# EAGLE design Main_Board (EAGLE 9.7.0)
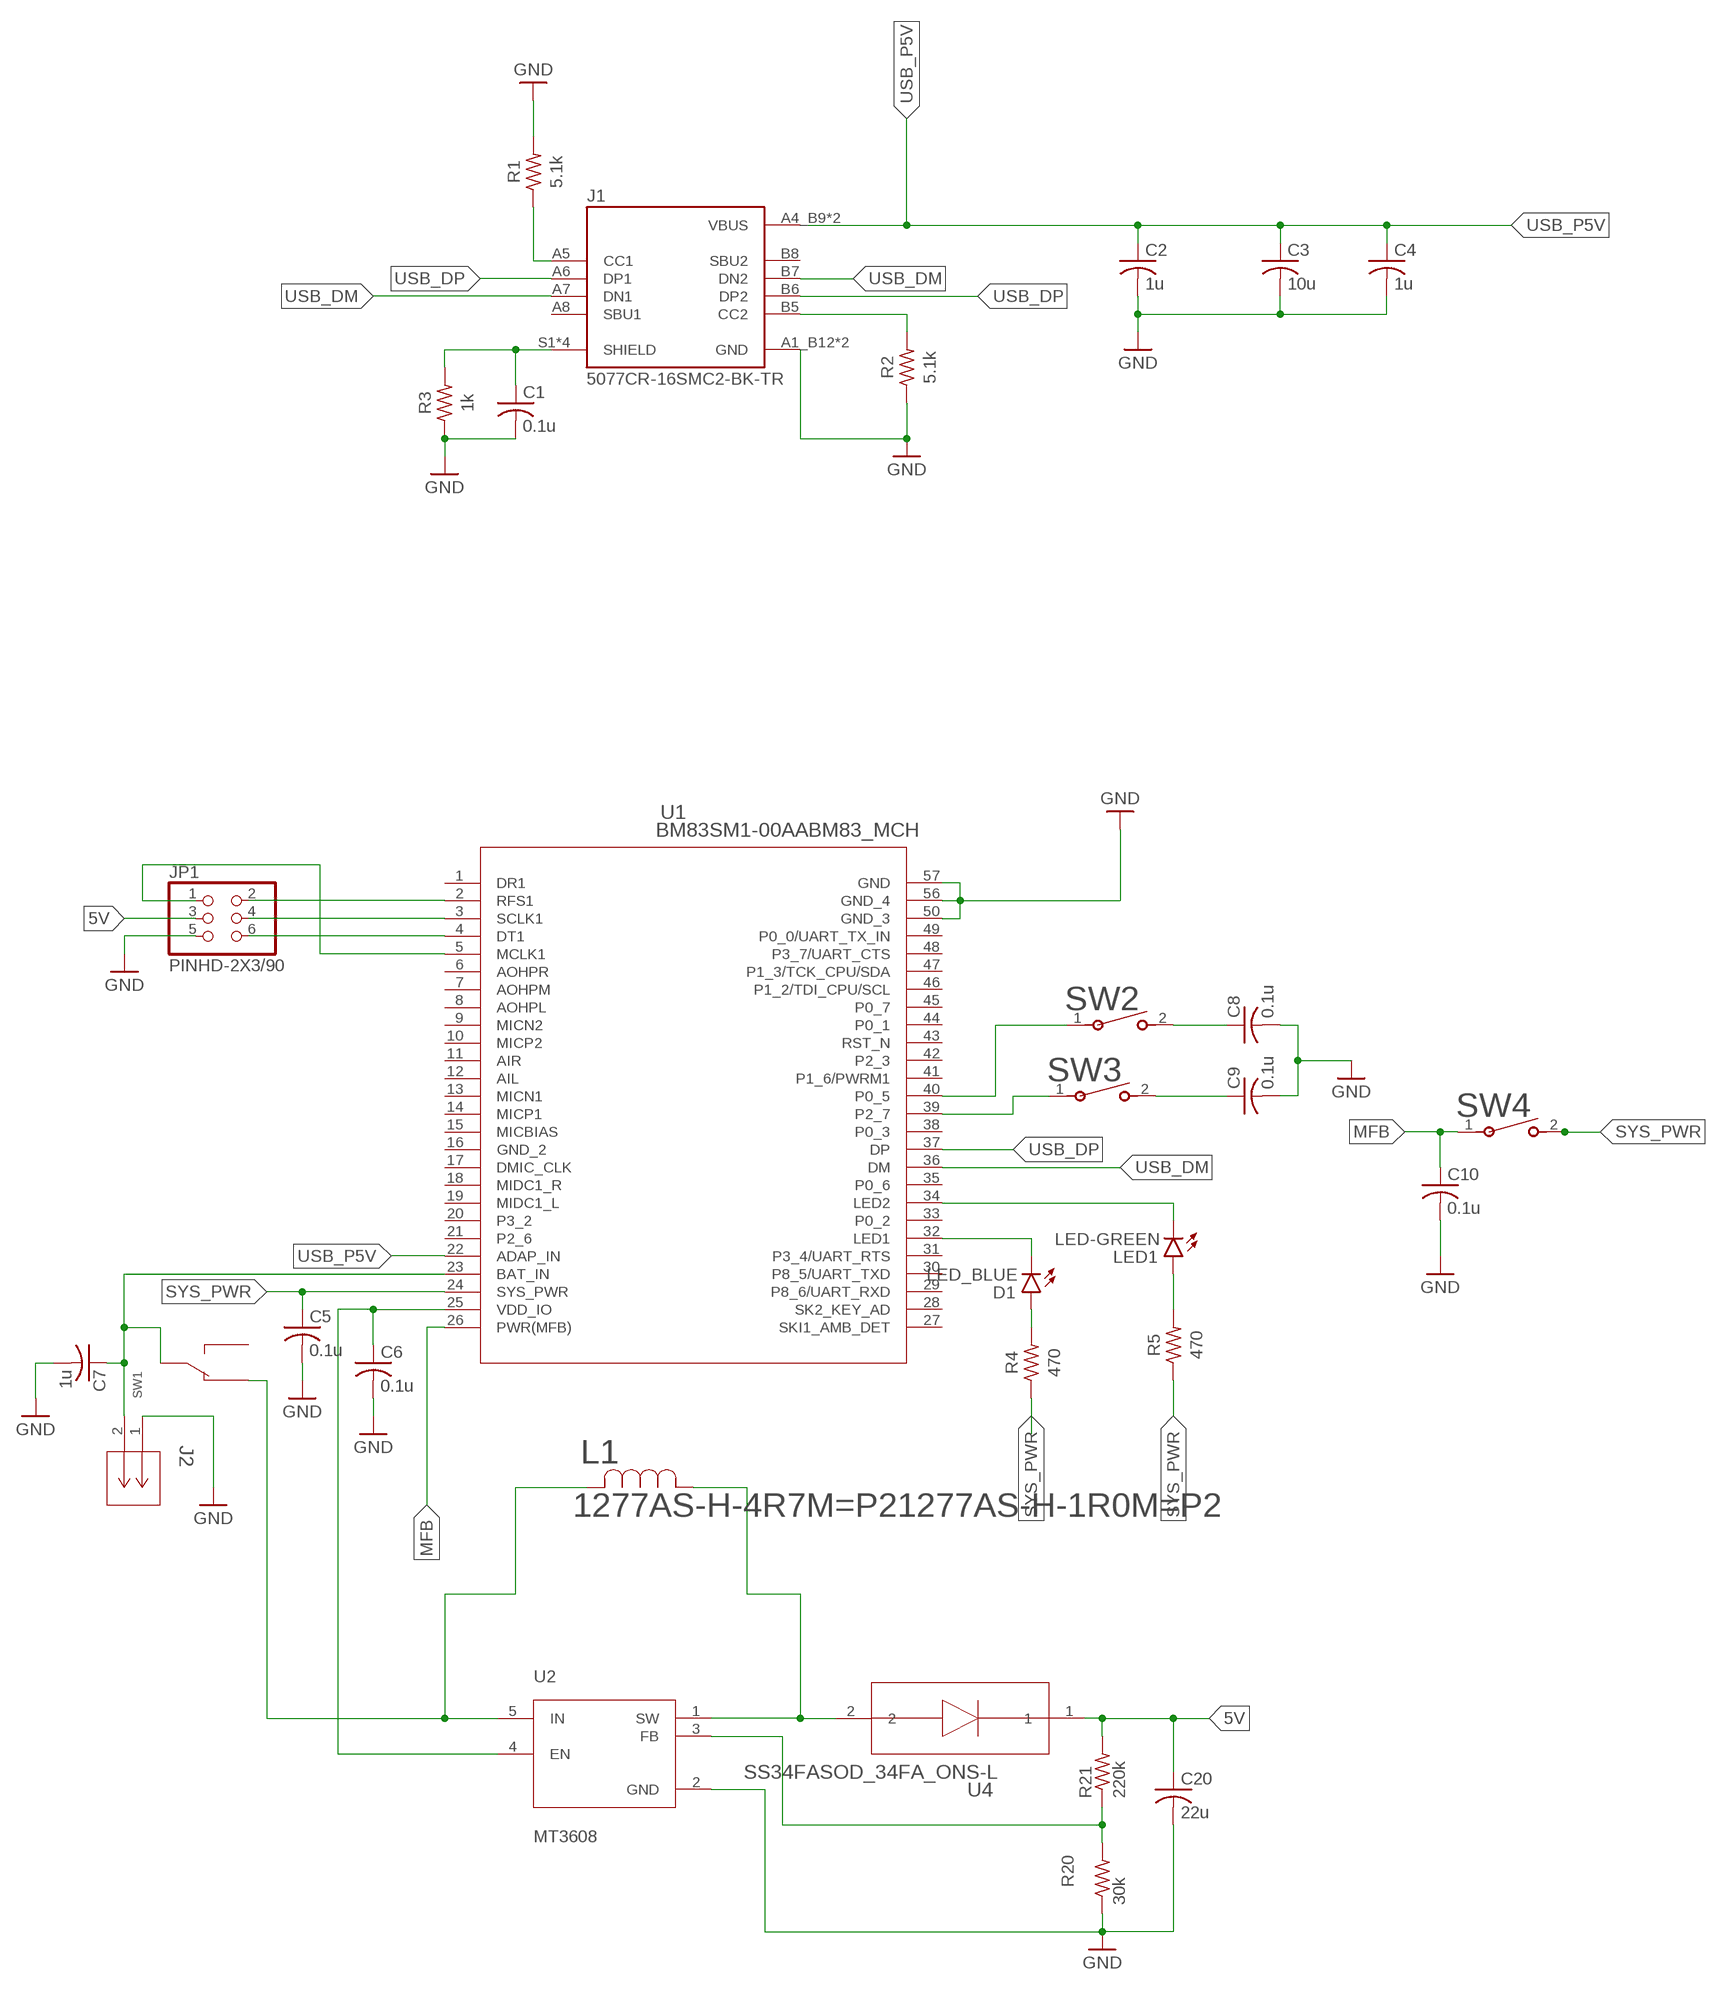
[diagram p0: schematic, sheet 1]

## Parts
C1  0.1u  C-US_CHIP-0603(1608-METRIC)  [CAPC1608X85]
C2  1u  C-US_CHIP-0603(1608-METRIC)  [CAPC1608X85]
C3  10u  C-US_CHIP-0603(1608-METRIC)  [CAPC1608X85]
C4  1u  C-US_CHIP-0603(1608-METRIC)  [CAPC1608X85]
C5  0.1u  C-US_CHIP-0603(1608-METRIC)  [CAPC1608X85]
C6  0.1u  C-US_CHIP-0603(1608-METRIC)  [CAPC1608X85]
C7  1u  C-US_CHIP-0603(1608-METRIC)  [CAPC1608X85]
C8  0.1u  C-US_CHIP-0603(1608-METRIC)  [CAPC1608X85]
C9  0.1u  C-US_CHIP-0603(1608-METRIC)  [CAPC1608X85]
C10  0.1u  C-US_CHIP-0603(1608-METRIC)  [CAPC1608X85]
C20  22u  C-US_CHIP-1206(3216-METRIC)  [CAPC3216X135]
D1  LED_BLUE  LED_CHIP_BLUE-1608  [LEDC1608X39N_B]
J1  5077CR-16SMC2-BK-TR  [NELTRON_5077CR-16SMC2-BK-TR]
J2  S2B-PH-K-S(LF)(SN)  [CONN_S2B-PH-K-S_JST]
JP1  PINHD-2X3/90  [2X03/90]
L1  1277AS-H-4R7M=P21277AS-H-1R0M=P2  [1277AS-H-1R0M=P2]
LED1  LED-GREEN  LED_CHIP_GREEN-1608  [LEDC1608X39N_G]
R1  5.1k  R-US_CHIP-0603(1608-METRIC)  [RESC1608X60]
R2  5.1k  R-US_CHIP-0603(1608-METRIC)  [RESC1608X60]
R3  1k  R-US_CHIP-0603(1608-METRIC)  [RESC1608X60]
R4  470  R-US_CHIP-0603(1608-METRIC)  [RESC1608X60]
R5  470  R-US_CHIP-0603(1608-METRIC)  [RESC1608X60]
R20  30k  R-US_CHIP-0603(1608-METRIC)  [RESC1608X60]
R21  220k  R-US_CHIP-0603(1608-METRIC)  [RESC1608X60]
SW1  MMS124  [MMS124]
SW2  EVP-AKE31ASW_EVP-AKE31A_PAN  [SW_EVP-AKE31A_PAN]
SW3  EVP-AKE31ASW_EVP-AKE31A_PAN  [SW_EVP-AKE31A_PAN]
SW4  EVP-AKE31ASW_EVP-AKE31A_PAN  [SW_EVP-AKE31A_PAN]
U1  BM83SM1-00AABM83_MCH  [BM83_MCH]
U2  MT3608  [SOT95P280X145-6N]
U4  SS34FASOD_34FA_ONS-L  [SOD_34FA_ONS-L]

## Nets
5V: C20.1 JP1.3 R21.2 U4.1
GND: C1.2 C2.2 C3.2 C4.2 C5.2 C6.2 C7.2 C8.2 C9.2 C10.2 C20.2 J1.A1_B12(GND) J1.B1_A12(GND) J2.1 JP1.5 R1.2 R2.1 R3.1 R20.1 U1.50(GND_3) U1.56(GND_4) U1.57(GND) U2.2(GND)
MFB: C10.1 SW4.1 U1.26(PWR(MFB))
N$1: J1.A5(CC1) R1.1
N$2: J1.B5(CC2) R2.2
N$3: C1.1 J1.S1(SHIELD) J1.S2(SHIELD) J1.S3(SHIELD) J1.S4(SHIELD) R3.2
N$4: L1.1 U2.1(SW) U4.2
N$5: JP1.2 U1.2(RFS1)
N$6: JP1.4 U1.3(SCLK1)
N$7: JP1.6 U1.4(DT1)
N$8: JP1.1 U1.5(MCLK1)
N$9: C7.1 J2.2 SW1.3 U1.23(BAT_IN)
N$10: SW2.1 U1.40(P0_5)
N$11: SW3.1 U1.39(P2_7)
N$12: C8.1 SW2.2
N$13: C9.1 SW3.2
N$20: R20.2 R21.1 U2.3(FB)
N$22: L1.2 SW1.1 U2.5(IN)
N$23: C6.1 U1.25(VDD_IO) U2.4(EN)
N$27: D1.1(C) U1.32(LED1)
N$28: D1.2(A) R4.2
N$29: LED1.1(C) U1.34(LED2)
N$30: LED1.2(A) R5.2
SYS_PWR: C5.1 R4.1 R5.1 SW4.2 U1.24(SYS_PWR)
USB_DM: J1.A7(DN1) J1.B7(DN2) U1.36(DM)
USB_DP: J1.A6(DP1) J1.B6(DP2) U1.37(DP)
USB_P5V: C2.1 C3.1 C4.1 J1.A4_B9(VBUS) J1.B4_A9(VBUS) U1.22(ADAP_IN)
Unconnected: J1.A8(SBU1) J1.B8(SBU2) SW1.2 U1.1(DR1) U1.6(AOHPR) U1.7(AOHPM) U1.8(AOHPL) U1.9(MICN2) U1.10(MICP2) U1.11(AIR) U1.12(AIL) U1.13(MICN1) U1.14(MICP1) U1.16(GND_2) U1.17(DMIC_CLK) U1.18(MIDC1_R) U1.19(MIDC1_L) U1.20(P3_2) U1.21(P2_6) U1.27(SKI1_AMB_DET) U1.28(SK2_KEY_AD) U1.29(P8_6/UART_RXD) U1.30(P8_5/UART_TXD) U1.31(P3_4/UART_RTS) U1.33(P0_2) U1.35(P0_6) U1.38(P0_3) U1.41(P1_6/PWRM1) U1.42(P2_3) U1.43(RST_N) U1.44(P0_1) U1.45(P0_7) U1.46(P1_2/TDI_CPU/SCL) U1.47(P1_3/TCK_CPU/SDA) U1.48(P3_7/UART_CTS) U1.49(P0_0/UART_TX_IN)

## Power pins joined to a net without a drawn wire
MICBIAS: U1.15(MICBIAS)

## Library data of the parts
C1-C10 C20 = Capacitor:C-US: Capacitor - ANSI; CATEGORY: Capacitor
D1 = Opto-Electronic:LED_CHIP: LED - Generic; CATEGORY: Opto-Electronic; COLOR: Blue; SUB-CATEGORY: LED
J1 = 5077CR-16SMC2-BK-TR:5077CR-16SMC2-BK-TR: Check availability <https://pricing.snapeda.com/parts/5077CR-16SMC2-BK-TR/Neltron/view-part?ref=eda>; AVAILABILITY: Not in stock; CHECK_PRICES: https://www.snapeda.com/parts/5077CR-16SMC2-BK-TR/Neltron/view-part/?ref=eda; DESCRIPTION: USB 3.1 C Type Female with Peg; MF: Neltron; MP: 5077CR-16SMC2-BK-TR; PACKAGE: Package; PRICE: None; SNAPEDA_LINK: https://www.snapeda.com/parts/5077CR-16SMC2-BK-TR/Neltron/view-part/?ref=snap
J2 = LipoConnector:S2B-PH-K-S(LF)(SN); COPYRIGHT: Copyright (C) 2024 Ultra Librarian. All rights reserved.; MANUFACTURER_PART_NUMBER: S2B-PH-K-S(LF)(SN); MFR_NAME: JST
JP1 = Connector:PINHD-2X3: PIN HEADER; CATEGORY: Headers; DESCRIPTION: Header, Right Angle, 2x3 Position; MANUFACTURER: Generic; MPN: Generic; OPERATING_TEMPERATURE: Generic; PART_STATUS: Active; PITCH: 0.100" (2.54mm); ROHS_COMPLIANCE: Generic; SERIES: Generic; SUB-CATEGORY: Headers, Male Pins; TYPE: Board to Board or Cable, Unshrouded, Through Hole, Right Angle
L1 = 2024-11-07_09-45-20_Library:1277AS-H-4R7M=P2; COPYRIGHT: Copyright (C) 2024 Ultra Librarian. All rights reserved.; MANUFACTURER_PART_NUMBER: 1277AS-H-4R7M=P2; MFR_NAME: Murata
LED1 = Tutorial - Fusion 360:LED_CHIP: LED - Generic; CATEGORY: Opto-Electronic; COLOR: Green; SUB-CATEGORY: LED
R1-R5 = Resistor:R-US: Resistor Fixed - ANSI; CATEGORY: Resistor; SUB-CATEGORY: Fixed
R20 R21 = Tutorial - Fusion 360:R-US: Resistor Fixed - ANSI; CATEGORY: Resistor; SUB-CATEGORY: Fixed
SW1 = KnitterSwitch:MMS124
SW2-SW4 = EVPAKE31A:EVP-AKE31A; COPYRIGHT: Copyright (C) 2024 Ultra Librarian. All rights reserved.; MANUFACTURER_PART_NUMBER: EVP-AKE31A; MFR_NAME: Panasonic
U1 = 2024-10-16_09-55-49_Library:BM83SM1-00AA; COPYRIGHT: Copyright (C) 2024 Ultra Librarian. All rights reserved.; MANUFACTURER_PART_NUMBER: BM83SM1-00AA; MFR_NAME: Microchip
U2 = MT3608:MT3608: High Efficiency 1.2MHz 2A Step Up Converter Check availability <https://pricing.snapeda.com/parts/MT3608/Aerosemi%20Technology%20Co.%2C%20Ltd/view-part?ref=eda>; AVAILABILITY: Not in stock; CHECK_PRICES: https://www.snapeda.com/parts/MT3608/Aerosemi+Technology+Co.%252C+Ltd/view-part/?ref=eda; DESCRIPTION: High Efficiency 1.2MHz 2A Step Up Converter; MF: Aerosemi Technology Co., Ltd; MP: MT3608; PACKAGE: Package; PRICE: None; SNAPEDA_LINK: https://www.snapeda.com/parts/MT3608/Aerosemi+Technology+Co.%252C+Ltd/view-part/?ref=snap
U4 = 2024-10-24_17-08-58_Library:SS34FA; COPYRIGHT: Copyright (C) 2024 Ultra Librarian. All rights reserved.; MANUFACTURER_PART_NUMBER: SS34FA; MFR_NAME: onsemi

## Board
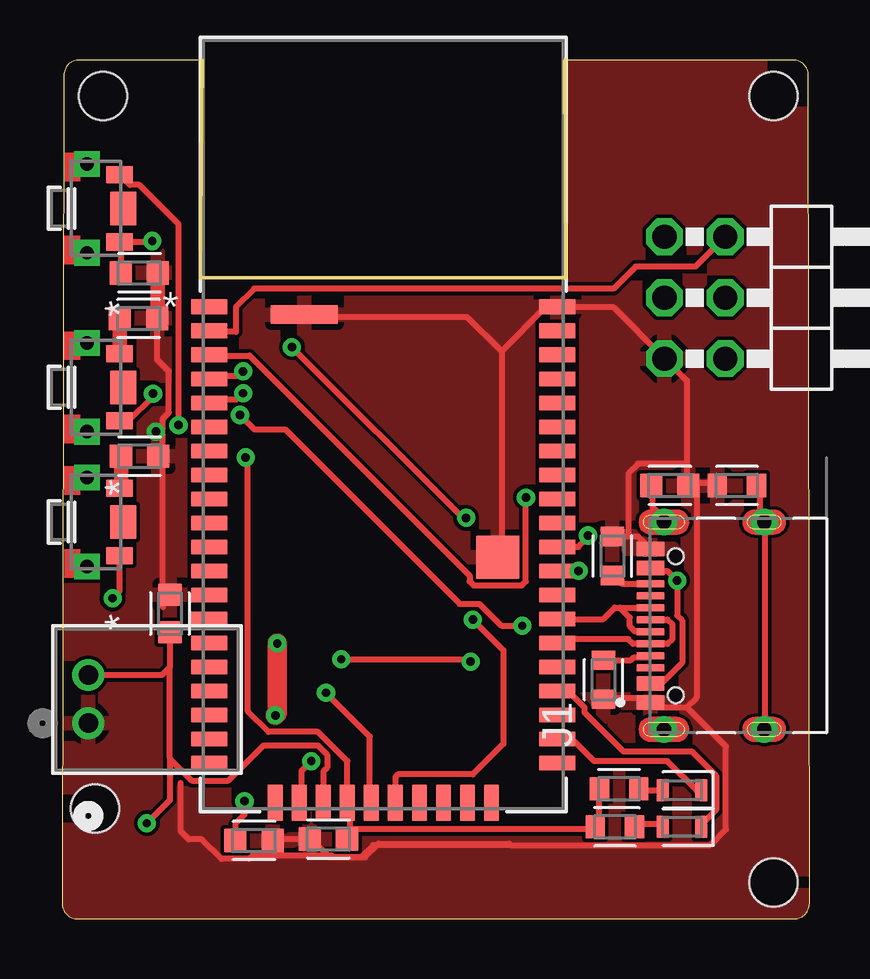
[diagram p1: board, top side]
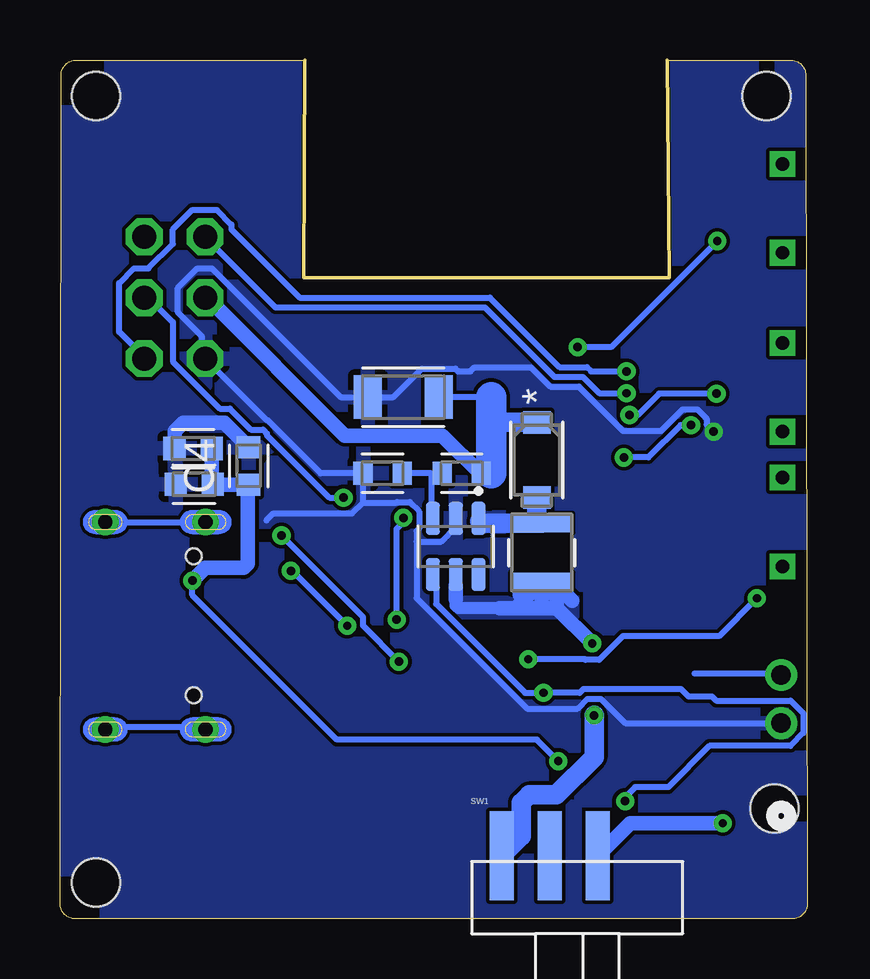
[diagram p2: board, bottom side, seen from below]

Size 31.14 x 35.79 mm. Coordinates in mm from the lower left corner, seen from the top.
Outline: 0.07,35.15 0,0.64 arc90 0.64,0 30.51,0 arc90 31.14,0.64 31.1,35.15 arc90 30.46,35.79 20.95,35.79 20.98,26.72 5.75,26.72 5.85,35.79 0.71,35.79 arc90 0.07,35.15
Copper layers (1*16): Top 0.035mm / dielectric 1.5mm / Bottom 0.035mm
Design rules "Fusion Electronics Design Rules *": minimum track width 10mil, minimum drill 0.35mm, track to track 6mil, track to pad 6mil, pad to pad 6mil, via to via 6mil, smd to smd 6mil, copper to edge 1mil, drill to drill 6mil, minimum pad ring 10mil, minimum via ring 8mil, stop-mask expansion 4mil, vias tented up to drill 0mil, thermal gap 10mil
Holes 2 mm at 1.7,34.29 1.37,4.6 29.64,34.29 29.64,1.52

### Footprints (pad centres in the part's own frame; a part is rotated, then mirrored left to right if it is on the bottom)
CAPC1608X85 = smd 0.921 x 0.97: 1 -0.775,0; 2 0.775,0
CAPC3216X135 = smd 1.165 x 1.815: 1 -1.475,0; 2 1.475,0
LEDC1608X39N_B = smd 0.512 x 0.912: 1 -0.8,0; 2 0.8,0
NELTRON_5077CR-16SMC2-BK-TR = smd 0.6 x 1.15: A1_B12 -3.2,1.065; A4_B9 -2.4,1.065; B1_A12 3.2,1.065; B4_A9 2.4,1.065 | smd 0.3 x 1.15: A5 -1.25,1.065; A6 -0.25,1.065; A7 0.25,1.065; A8 1.25,1.065; B5 1.75,1.065; B6 0.75,1.065; B7 -0.75,1.065; B8 -1.75,1.065 | drill 0.6 pad 1: S1 -4.32,-3.68; S2 4.32,-3.68; S3 -4.32,0.5; S4 4.32,0.5 | hole 0.65: -2.89,0; 2.89,0
CONN_S2B-PH-K-S_JST = drill 0.813 pad 1.321: 1 0,0; 2 2.007,0
2X03/90 = drill 1.016 octagon: 1 -2.54,-6.35; 2 -2.54,-3.81; 3 0,-6.35; 4 0,-3.81; 5 2.54,-6.35; 6 2.54,-3.81
1277AS-H-1R0M=P2 = smd 0.75 x 2.489: 1 -1.225,0; 2 1.225,0
LEDC1608X39N_G = smd 0.512 x 0.912: 1 -0.8,0; 2 0.8,0
RESC1608X60 = smd 0.799 x 0.974: 1 -0.815,0; 2 0.815,0
MMS124 = smd 1 x 3.7: 1 -3.15,3.25; 2 -1.15,3.25; 3 0.85,3.25
SW_EVP-AKE31A_PAN = smd 0.711 x 1.092: 1 -1.4,-0.972; 2 1.4,-0.972 | drill 0.559 pad 0.914 square: 3 -1.848,0.381; 4 1.848,0.381 | smd 1.397 x 1.092: 5 0,-1.124
BM83_MCH = smd 1.499 x 0.61: 1 -7.25,4.907; 2 -7.25,3.906; 3 -7.25,2.906; 4 -7.25,1.905; 5 -7.25,0.904; 6 -7.25,-0.097; 7 -7.25,-1.097; 8 -7.25,-2.098; 9 -7.25,-3.099; 10 -7.25,-4.1; 11 -7.25,-5.1; 12 -7.25,-6.101; 13 -7.25,-7.102; 14 -7.25,-8.103; 15 -7.25,-9.103; 16 -7.25,-10.104; 17 -7.25,-11.105; 18 -7.25,-12.106; 19 -7.25,-13.106; 20 -7.25,-14.107; 31 7.25,-14.107; 32 7.25,-13.106; 33 7.25,-12.106; 34 7.25,-11.105; 35 7.25,-10.104; 36 7.25,-9.103; 37 7.25,-8.103; 38 7.25,-7.102; 39 7.25,-6.101; 40 7.25,-5.1; 41 7.25,-4.1; 42 7.25,-3.099; 43 7.25,-2.098; 44 7.25,-1.097; 45 7.25,-0.097; 46 7.25,0.904; 47 7.25,1.905; 48 7.25,2.906; 49 7.25,3.906; 50 7.25,4.907 | smd 0.61 x 1.499: 21 -4.503,-15.751; 22 -3.503,-15.751; 23 -2.502,-15.751; 24 -1.501,-15.751; 25 -0.5,-15.751; 26 0.5,-15.751; 27 1.501,-15.751; 28 2.502,-15.751; 29 3.503,-15.751; 30 4.503,-15.751 | smd 1.778 x 1.778: 56 4.77,-5.53 | smd 2.794 x 0.762: 57 -3.289,4.58
SOT95P280X145-6N = smd 1.37 x 0.59: 1 -1.17,0.95; 2 -1.17,0; 3 -1.17,-0.95; 4 1.17,-0.95; 5 1.17,0; 6 1.17,0.95
SOD_34FA_ONS-L = smd 0.94 x 1.143: 1 -1.562,0; 2 1.562,0

### Placement (x,y rotation side)
C1  25.32,18.06 0 top
C2  25.55,18.11 180 bottom
C3  25.6,19.6 180 bottom
C4  23.28,18.87 90 bottom
C5  11.1,3.33 180 top
C6  8,3.27 0 top
C7  4.49,12.73 90 top
C8  3.23,19.27 0 top
C9  3.18,25.02 0 top
C10  3.22,26.92 0 top
C20  16.84,21.74 180 bottom
D1  25.83,5.36 180 top
J1  25.58,12.22 90 top
J2  1.09,8.15 90 top
JP1  31.44,25.88 270 top
L1  11.07,15.27 270 bottom
LED1  25.83,3.84 180 top
R1  22.56,9.97 270 top
R2  22.93,15.12 270 top
R3  28.12,18.06 0 top
R4  23.21,5.42 0 top
R5  23.04,3.84 0 top
R20  17.7,18.57 0 bottom
R21  14.4,18.57 0 bottom
SW1  9.59,-0.61 0 bottom
SW2  1.42,16.54 90 top
SW3  1.42,22.15 90 top
SW4  1.42,29.6 90 top
U1  13.38,20.6 0 top
U2  14.65,15.52 270 bottom
U4  11.28,19.13 270 bottom

### Tracks (layer width: path | path; a pad name or v marks a point on that pad's centre or on a via)
5V
  Bottom 0.254: 13.23,18.57 R21.2 | 13.44,18.57 R21.2 | 13.18,21.74 C20.1 | R21.2 13.64,18.57 | JP1.3 25.02,25.88
  Bottom 0.61: 13.64,18.57 15.21,20.14 19.28,20.14 25.02,25.88
  Bottom 0.813: 13.18,18.57 13.23,18.57 | U4.1 11.29,20.7 13.18,20.7
  Bottom 1.27: 13.18,18.57 13.18,20.7 13.18,21.74
GND  (via drill 0.35)
  Top 0.254: C6.2 8.87,3.33 10.18,3.33 C5.2 10.39,3.33 11.15,2.57 12.62,2.57 13.19,3.14 18.62,3.14 18.69,3.07 | R1.2 22.58,9.22 24.41,9.22 J1.A1_B12 24.61,9.02 24.81,8.81 26.03,8.81 | 26.03,8.81 27.66,7.19 27.66,3.73 27,3.07 18.69,3.07 | 4.49,13.69 C7.2 | 23.6,15.93 24,15.93 24.41,15.52 J1.B1_A12 | 23.6,15.93 23.06,15.93 R2.1 | 26.44,18.16 27.25,18.16 R3.1 | 26.44,18.16 26.24,18.16 C1.2 | 26.03,18.97 26.03,22.43 25.22,23.24 JP1.5 25.02,23.44 22.99,25.48 20.75,25.48 U1.50 20.55,25.48 20.14,25.48 18.31,23.65 | 26.03,18.97 26.03,18.16 C1.2 | 18.31,23.65 18.31,15.11 U1.56 | 23.6,15.93 23.6,18.57 24,18.97 26.03,18.97 | 18.31,23.65 16.89,25.07 10.18,25.07 U1.57 | 26.03,8.81 26.44,9.22 26.44,18.16 | 26.44,18.16 C1.2 | 18.69,3.07 12.96,3.07 12.45,2.57 11.3,2.57 11.22,2.64 7.94,2.64 7.8,2.5 6.65,2.5 5.83,3.32 5.28,3.32 4.94,3.66 4.94,5.67 | C9.2 3.96,23.31 4.45,22.82 4.45,21.1 4.2,20.85 4.2,12.99
  Top 0.61: C10.2 3.99,25.05 C9.2
  Bottom 0.254: 18.52,17.35 R20.1 20.29,18.57 22.52,20.79 22.54,20.79 JP1.5 25.22,23.44 25.22,24.26 26.24,25.27 26.24,26.29 25.42,27.1 24.81,27.1 19.46,21.74 C20.2 17.25,21.74 16.06,22.93 14.67,22.93 14.55,22.82 14.04,22.82 13.88,22.98 11.52,22.98 10.72,22.17 9.52,22.17 7.69,20.34 6.09,20.34 5.2,21.23 4.58,21.23 4.2,20.85 4.2,20.59 v3.91,20.3 | U2.2 14.65,16.33 15.26,15.72 16.28,15.72 | 16.28,15.72 16.28,13.36 11.68,8.77 9.58,8.77 9.17,9.17 8.61,9.17 7.59,8.15 J2.1 | 18.52,17.35 18.97,16.89 22.26,16.89 22.54,16.61 | 18.52,17.35 17.13,17.35 17.11,17.37 16.56,17.37 16.18,16.99 16.18,16.27 16.28,16.16 16.28,15.72 | 26.16,19.6 C3.2
  Bottom 0.61: 26.35,18.13 C2.2 | C4.2 23.91,20.27 23.91,20.28 24.31,20.68 26.01,20.68 26.37,20.31 C3.2
  pour Bottom (rank 2): 42.52,0.89 42.52,39.47 -0.75,39.47 -0.83,39.49 -0.9,39.53 -1.22,39.85 -4.01,37.06 -4.01,-3.3 -2.11,-5.21 36.42,-5.21
  pour Top (rank 2): -3.63,-2.72 32.89,-2.72 42.16,6.55 42.16,36.35 39.22,39.29 1.32,39.29 -7.75,30.23 -7.75,1.4
MFB  (via drill 0.35)
  Top 0.254: C10.1 2.44,28.16 SW4.1 3.72,28.2 v3.76,28.24 | v16.84,16.71 16.69,16.71 v9.57,23.83 | v17.12,12.47 18.39,11.2 18.39,7.29 17.12,6.02 13.99,6.02 13.89,5.91 U1.26
  Bottom 0.254: v3.76,28.24 8.18,23.83 v9.57,23.83 | v17.12,12.47 17.12,16.26 16.84,16.54 v16.84,16.71
N$1
  Top 0.254: J1.A5 24.44,10.9 23.82,10.9 23.71,10.78 R1.1
N$2
  Top 0.254: R2.2 22.98,14.31 23.32,13.97 J1.B5
N$3
  Top 0.254: C1.1 24.61,17.96 24.61,17.14 25.02,16.74 J1.S4 | R3.2 29.08,17.96 29.08,16.74 J1.S2 29.29,16.54 29.29,8 J1.S1
  Bottom 0.254: J1.S3 25.22,8 29.08,8 J1.S1 | J1.S4 25.22,16.54 29.08,16.54 J1.S2
N$4
  Bottom 0.254: 13.64,16.54 13.65,16.56 U2.1
  Bottom 0.813: U4.2 11.28,16.69 L1.1 13.58,16.49 13.65,16.56
  pour Bottom: 12.17,16.33 13.33,16.33 13.33,16.74 12.17,16.74
N$5
  Top 0.254: U1.2 6.32,24.46 7.24,24.46 7.24,25.5 8,26.26 22.99,26.26 23.9,27.18 26.39,27.18 JP1.2
N$6  (via drill 0.35)
  Top 0.254: v19.33,17.55 v19.32,17.55 19.32,14.06 19.16,13.9 17.15,13.9 16.99,14.06 16.99,14.3 7.82,23.47 6.17,23.47 U1.3
  Bottom 0.254: JP1.4 27.46,25.88 26.44,24.87 26.44,23.22 24.48,21.26 24.06,21.26 23.19,20.39 22.68,20.39 22.52,20.22 22.52,20.15 19.92,17.55 v19.33,17.55
N$7  (via drill 0.35)
  Top 0.254: U1.4 6.26,22.63 7.36,22.63 v7.54,22.81
  Bottom 0.254: JP1.6 27.66,23.44 28.68,24.46 28.68,26.49 28.07,27.1 27.46,27.1 26.44,28.12 26.44,28.73 25.63,29.54 24.61,29.54 24,28.93 24,28.73 21.16,25.88 13.23,25.88 10.34,22.99 9.19,22.99 9.01,22.81 v7.54,22.81
N$8  (via drill 0.35)
  Top 0.254: v7.54,21.9 7.29,21.65 6.28,21.65 U1.5
  Bottom 0.254: JP1.1 25.02,28.32 22.17,25.48 13.44,25.48 10.54,22.58 9.35,22.58 8.68,21.9 v7.54,21.9
N$9  (via drill 0.35)
  Top 0.254: U1.23 10.88,6.14 11.04,6.3 11.04,6.85 10.65,7.23 8.4,7.23 6.93,5.77 5.41,5.77 4.49,6.68 | C7.1 4.49,10.49 | 4.49,10.49 4.16,10.16 J2.2 | 4.49,6.68 4.49,6.71 4.49,10.49 | 4.49,6.68 4.49,4.95 v3.53,3.99
  Bottom 0.254: 4.7,10.24 1.17,10.24 J2.2
  Bottom 0.61: SW1.3 7.39,3.99 v3.53,3.99
N$10  (via drill 0.35)
  Top 0.254: U1.40 21.52,15.5 21.97,15.95 21.95,15.97 v21.91,15.97 | SW2.1 2.38,13.63 v2.11,13.36 | v11.63,10.82 16.93,10.82 v17.02,10.72
  Bottom 0.254: v17.02,10.72 18.52,12.22 18.52,12.58 v21.91,15.97 | v11.63,10.82 9.27,10.82 9.25,10.79 8.68,10.79 7.69,11.79 3.68,11.79 v2.11,13.36
N$11  (via drill 0.35)
  Top 0.254: U1.39 v21.52,14.5 v21.53,14.5 | v19.18,12.22 18.3,12.22 17.39,13.13 16.56,13.13 9.3,20.4 8.01,20.4 v7.41,21 | SW3.1 2.78,20.75 3.79,21.75 v3.79,21.89
  Bottom 0.254: v21.53,14.5 21.46,14.5 v19.18,12.22 | v3.79,21.89 6.18,21.89 7.07,21 v7.41,21
N$12
  Top 0.254: 2.42,19.24 C8.1
  Top 0.61: C8.1 2.46,18.02 SW2.2
N$13
  Top 0.61: C9.1 2.41,23.59 SW3.2
N$20
  Bottom 0.254: 15.67,18.57 R20.2 | 15.67,18.57 R21.1 | 15.67,18.57 15.67,16.74 U2.3
N$22  (via drill 0.35)
  Top 0.813: v8.97,11.48 8.97,8.56 v8.89,8.48
  Bottom 0.254: 14.65,13.89 U2.5 | 10.38,14.07 10.32,14.13 10.18,14.27
  Bottom 0.508: 11.4,12.95 12.17,12.95 12.83,12.95 14.54,12.95 14.65,13.07 14.65,13.32
  Bottom 0.61: 14.65,13.32 14.65,13.89 | v8.97,11.48 10.44,12.95 | 10.44,12.95 11.02,12.95 | 11.02,12.95 12.17,12.95 | 12.83,12.95 12.16,12.95 11.79,13.32 | 10.44,13.41 10.44,12.95 | L1.2 10.41,14.04 10.38,14.07 | 10.44,13.41 10.32,13.53 10.32,14.13 | 10.44,13.41 L1.2 | L1.2 11.07,13 11.02,12.95 | L1.2 11.79,13.32 | 11.79,13.32 11.79,13.8 11.99,14 11.99,13.51 11.79,13.32 | L1.2 10.59,14.04 9.8,13.26
  Bottom 0.813: SW1.1 11.92,3.45 11.92,4.85 11.6,5.17 10.46,5.17 8.89,6.74 v8.89,8.48
  pour Bottom: 14.22,13.38 14.17,13.36 11.58,13.36 11.53,13.38 11.5,13.42 11.48,13.46 11.48,13.64 11.4,13.72 9.63,13.72 9.63,12.6 14.6,12.6 14.78,12.78 14.78,14.88 14.53,14.88 14.53,13.72 14.51,13.67
N$23  (via drill 0.35)
  Top 0.254: v11,9.42 12.83,7.59 12.83,4.95 U1.25 | C6.1 7.22,3.97 7.6,4.34 v7.6,4.91
  Bottom 0.254: U2.4 15.47,14.3 15.47,13.12 11.77,9.42 v11,9.42 9.49,9.42 9.34,9.58 5.27,9.58 4.96,9.27 3.98,9.27 3.8,9.09 0.7,9.09 0.17,8.56 0.17,7.75 0.7,7.21 4.08,7.21 5.8,5.5 7.18,5.5 7.6,5.08 v7.6,4.91
N$27
  Top 0.254: D1.1 26.44,5.36 25.22,6.58 22.17,6.58 21.36,7.39 20.75,7.39 U1.32
N$28
  Top 0.254: D1.2 24.21,5.36 R4.2
N$29
  Top 0.254: LED1.1 26.64,3.94 27.25,4.55 27.25,5.97 26.24,6.98 23.39,6.98 21.77,8.61 21.77,8.81 21.16,9.42 20.75,9.42 U1.34
N$30
  Top 0.254: LED1.2 25.02,3.94 24,3.94 R5.2
SYS_PWR  (via drill 0.35)
  Top 0.254: R4.1 22.38,5.36 22.38,3.94 R5.1 22.17,3.73 12.01,3.73 | 12.01,3.73 12.01,4.75 U1.24 11.88,6.58 10.66,7.8 8.61,7.8 7.75,8.66 7.75,19.13 v7.65,19.23 | 12.01,3.73 12.01,3.53 C5.1 12.01,3.73 | SW4.2 2.82,30.58 3.21,30.58 4.85,28.94 v4.85,20.57
  Bottom 0.254: v4.85,20.57 5.28,20.57 6.63,19.23 v7.65,19.23
USB_DM
  Top 0.254: J1.A7 24.61,12.47 25.22,12.47 25.42,12.27 25.42,11.66 25.22,11.46 24.61,11.46 J1.B7 24.41,11.46 23.8,11.46 23.6,11.66 20.75,11.66 U1.36
USB_DP
  Top 0.254: U1.37 22.55,12.5 23.02,12.97 23.24,12.97 | 23.24,12.97 J1.B6 | 23.24,12.97 23.66,12.55 23.66,12.2 23.89,11.97 J1.A6
USB_P5V  (via drill 0.35)
  Top 0.254: J1.B4_A9 24.61,14.5 25.22,14.5 v25.63,14.1 25.63,12.64 25.83,12.44 25.83,10.67 24.98,9.82 J1.A4_B9 | v10.38,6.57 9.98,6.17 9.98,4.95 U1.22
  Bottom 0.254: v10.38,6.57 11.28,7.47 19.61,7.47 25.63,13.49 v25.63,14.1
  Bottom 0.61: C3.1 24.82,18.16 C2.1 24.76,18.1 C4.1 23.32,18.07 23.32,14.81 23.49,14.63 25.09,14.63 v25.63,14.1